# EAGLE design driver_5 (EAGLE 9.3.1)
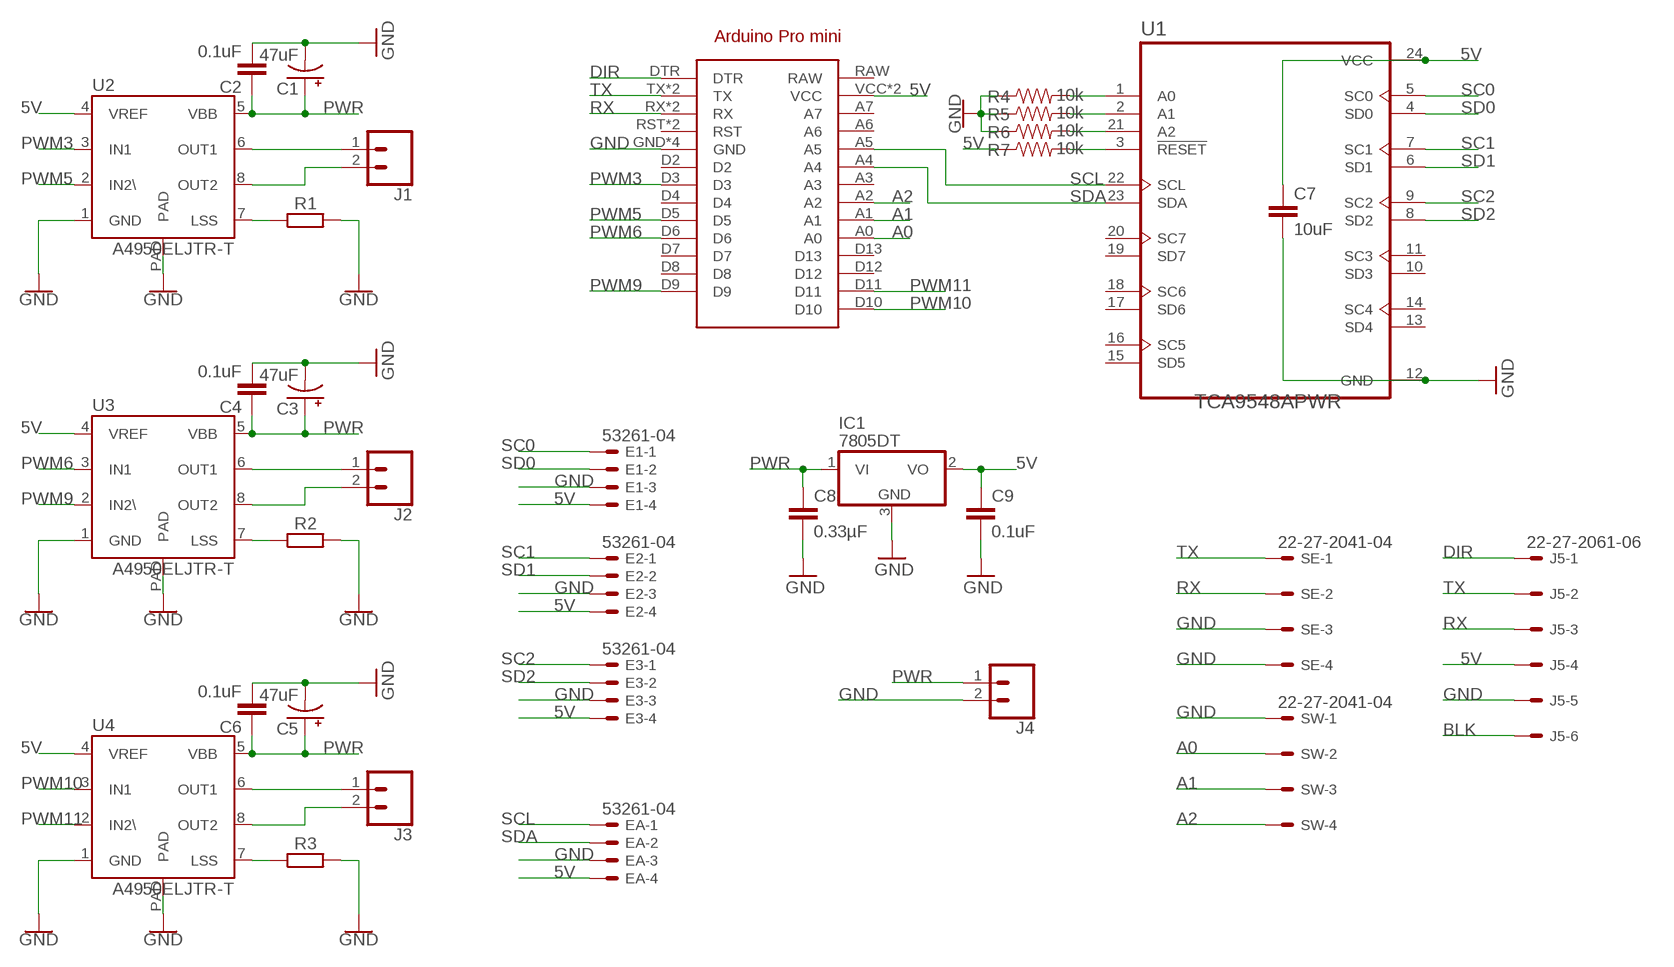
[diagram p0: schematic, sheet 1]

## Parts
ARDUINO1  ARDUINO_PRO_MINI  [ARDUINO_PRO_MINI]
C1  47uF  47UF-POLAR-EIA3528-10V-10%  [EIA3528]
C2  0.1uF  0.1UF-0402-16V-10%  [0402]
C3  47uF  47UF-POLAR-EIA3528-10V-10%  [EIA3528]
C4  0.1uF  0.1UF-0402-16V-10%  [0402]
C5  47uF  47UF-POLAR-EIA3528-10V-10%  [EIA3528]
C6  0.1uF  0.1UF-0402-16V-10%  [0402]
C7  10uF  10UF-0603-6.3V-20%  [0603]
C8  0.33µF  0.33UF/330NF-0805-50V-10%  [0805]
C9  0.1uF  0.1UF-0603-25V-(+80/-20%)  [0603]
E1  53261-04  [53261-04]
E2  53261-04  [53261-04]
E3  53261-04  [53261-04]
EA  53261-04  [53261-04]
IC1  7805DT  [TO252]
J1  CONN_025MM  [SCREWTERMINAL-5MM-2]
J2  CONN_025MM  [SCREWTERMINAL-5MM-2]
J3  CONN_025MM  [SCREWTERMINAL-5MM-2]
J4  CONN_025MM  [SCREWTERMINAL-5MM-2]
J5  22-27-2061-06  [6410-06]
R1  0.22  RR2512  [R2512]
R2  0.22  RR2512  [R2512]
R3  0.22  RR2512  [R2512]
R4  10k  10KOHM-0603-1/10W-1%  [0603]
R5  10k  10KOHM-0603-1/10W-1%  [0603]
R6  10k  10KOHM-0603-1/10W-1%  [0603]
R7  10k  10KOHM-0603-1/10W-1%  [0603]
SE  22-27-2041-04  [6410-04]
SW  22-27-2041-04  [6410-04]
U1  TCA9548APWR  [SOP65P640X120-24N]
U2  A4950ELJTR-T  [SOIC8TP]
U3  A4950ELJTR-T  [SOIC8TP]
U4  A4950ELJTR-T  [SOIC8TP]

## Nets
5V: ARDUINO1.VCC ARDUINO1.VCC@1(VCC) C7.1 C9.1 E1.4 E2.4 E3.4 EA.4 IC1.2(VO) J5.4 R7.1 U1.24(VCC) U2.4(VREF) U3.4(VREF) U4.4(VREF)
A0: ARDUINO1.A0 SW.2
A1: ARDUINO1.A1 SW.3
A2: ARDUINO1.A2 SW.4
BLK: J5.6
DIR: ARDUINO1.DTR J5.1
GND: ARDUINO1.GND ARDUINO1.GND@1(GND) ARDUINO1.GND@2(GND) ARDUINO1.GND@3(GND) C1.C(-) C2.2 C3.C(-) C4.2 C5.C(-) C6.2 C7.2 C8.2 C9.2 E1.3 E2.3 E3.3 EA.3 IC1.3(GND) J4.2 J5.5 R1.2 R2.2 R3.2 R4.1 R5.1 R6.1 SE.3 SE.4 SW.1 U1.12(GND) U2.1(GND) U2.PAD U3.1(GND) U3.PAD U4.1(GND) U4.PAD
N$3: R1.1 U2.7(LSS)
N$4: R4.2 U1.1(A0)
N$5: J1.1 U2.6(OUT1)
N$6: J1.2 U2.8(OUT2)
N$7: R2.1 U3.7(LSS)
N$8: J2.1 U3.6(OUT1)
N$9: J2.2 U3.8(OUT2)
N$10: R3.1 U4.7(LSS)
N$11: J3.1 U4.6(OUT1)
N$12: J3.2 U4.8(OUT2)
N$13: R5.2 U1.2(A1)
N$14: R6.2 U1.21(A2)
N$15: R7.2 U1.3(!RESET)
PWM3: ARDUINO1.D3 U2.3(IN1)
PWM5: ARDUINO1.D5 U2.2(IN2\)
PWM6: ARDUINO1.D6 U3.3(IN1)
PWM9: ARDUINO1.D9 U3.2(IN2\)
PWM10: ARDUINO1.D10 U4.3(IN1)
PWM11: ARDUINO1.D11 U4.2(IN2\)
PWR: C1.A(+) C2.1 C3.A(+) C4.1 C5.A(+) C6.1 C8.1 IC1.1(VI) J4.1 U2.5(VBB) U3.5(VBB) U4.5(VBB)
RX: ARDUINO1.RX ARDUINO1.RX@1(RX) J5.3 SE.2
SC0: E1.1 U1.5(SC0)
SC1: E2.1 U1.7(SC1)
SC2: E3.1 U1.9(SC2)
SCL: ARDUINO1.A5 EA.1 U1.22(SCL)
SD0: E1.2 U1.4(SD0)
SD1: E2.2 U1.6(SD1)
SD2: E3.2 U1.8(SD2)
SDA: ARDUINO1.A4 EA.2 U1.23(SDA)
TX: ARDUINO1.TX ARDUINO1.TX@1(TX) J5.2 SE.1
Unconnected: ARDUINO1.A3 ARDUINO1.A6 ARDUINO1.A7 ARDUINO1.D2 ARDUINO1.D4 ARDUINO1.D7 ARDUINO1.D8 ARDUINO1.D12 ARDUINO1.D13 ARDUINO1.RAW ARDUINO1.RST ARDUINO1.RST@1(RST) U1.10(SD3) U1.11(SC3) U1.13(SD4) U1.14(SC4) U1.15(SD5) U1.16(SC5) U1.17(SD6) U1.18(SC6) U1.19(SD7) U1.20(SC7)

## Library data of the parts
ARDUINO1 = ArduinoProMini:ARDUINO_PRO_MINI: For creating Arduino Pro Mini shields
C1 C3 C5 = SparkFun-Capacitors:47UF-POLAR: 47µF polarized capacitors A capacitor is a passive two-terminal electrical component used to store electrical energy temporarily in an electric field.; PROD_ID: CAP-08310
C2 C4 C6 = SparkFun-Capacitors:0.1UF: 0.1µF ceramic capacitors A capacitor is a passive two-terminal electrical component used to store electrical energy temporarily in an electric field.; PROD_ID: CAP-12416
C7 = SparkFun-Capacitors:10UF: 10.0µF ceramic capacitors A capacitor is a passive two-terminal electrical component used to store electrical energy temporarily in an electric field.; PROD_ID: CAP-11015
C8 = SparkFun-Capacitors:0.33UF/330NF: 0.33µF/330nF ceramic capacitors A capacitor is a passive two-terminal electrical component used to store electrical energy temporarily in an electric field.; PROD_ID: CAP-08469
C9 = SparkFun-Capacitors:0.1UF: 0.1µF ceramic capacitors A capacitor is a passive two-terminal electrical component used to store electrical energy temporarily in an electric field.; PROD_ID: CAP-00810
E1-E3 EA = con-molex:53?-04: CONNECTOR wire to board 1.25 mm (.049 inch) pitch header; MF: MOLEX; OC_FARNELL: 1125374; OC_NEWARK: unknown
IC1 = adafruit:78*: Positive VOLTAGE REGULATOR Added bigger pads to the TO-92 package
J1-J4 = SparkFun-Connectors:CONN_02: Multi connection point. Often used as Generic Header-pin footprint for 0.1 inch spaced/style header connections On any of the 0.1 inch spaced packages, you can populate with these: Break Away Headers - Straight <https://www.sparkfun.com/products/116> (PRT-00116) Break Away Male Headers - Right Angle <https://www.sparkfun.com/products/553> (PRT-00553) Female Headers <https://www.sparkfun.com/products/115> (PRT-00115) Break Away Headers - Machine Pin <https://www.sparkfun.com/products/117> (PRT-00117) Break Away Female Headers - Swiss Machine Pin <https://www.sparkfun.com/products/743> (PRT-00743) For SCREWTERMINALS and SPRING TERMINALS visit here: Screw Terimnals on SparkFun.com <https://www.sparkfun.com/search/results?term=Screw+Terminals> (5mm/3.5mm/2.54mm spacing) This device is also useful as a general connection point to wire up your design to another part of your project. Our various solder wires solder well into these plated through hole pads. Hook-Up Wire - Assortment (Stranded, 22 AWG) <https://www.sparkfun.com/products/11375> (PRT-11375) Hook-Up Wire - Assortment (Solid Core, 22 AWG) <https://www.sparkfun.com/products/11367> (PRT-11367) View the entire wire category on our website here <https://www.sparkfun.com/categories/141> Special notes: Molex polarized connector foot print use with: PRT-08233 with associated crimp pins and housings. 2.54_SCREWTERM for use with PRT-10571. 3.5mm Screw Terminal footprints for PRT-08084 5mm Screw Terminal footprints for use with PRT-08432; SF_SKU: PRT-08432
J5 = con-molex:22-?-06: CONNECTOR wire to board 2.54 mm (.1 inch) pitch header; MF: MOLEX; OC_FARNELL: unknown; OC_NEWARK: unknown
R1-R3 = eagle-ltspice:R: RESISTOR, European symbol; SPICEMODEL: NONE; SPICEPREFIX: R
R4-R7 = SparkFun-Resistors:10KOHM: 10kΩ resistor A resistor is a passive two-terminal electrical component that implements electrical resistance as a circuit element. Resistors act to reduce current flow, and, at the same time, act to lower voltage levels within circuits. - Wikipedia; PROD_ID: RES-00824
SE SW = con-molex:22-?-04: CONNECTOR wire to board 2.54 mm (.1 inch) pitch header; MF: MOLEX; OC_FARNELL: unknown; OC_NEWARK: unknown
U1 = TCA9548APWR:TCA9548APWR: Low-Voltage 8-Channel I2C Switch With Reset 24-TSSOP -40 to 85; AVAILABILITY: Unavailable; DESCRIPTION: Low-Voltage 8-Channel I2C Switch With Reset 24-TSSOP -40 to 85; MF: Texas Instruments; MP: TCA9548APWR; PACKAGE: TSSOP-24 Texas Instruments; PRICE: None
U2-U4 = A4950ELJTR-T:A4950ELJTR-T: IC MOTOR DRIVER PAR 8SOIC tested: YES (parallel gripper mcb); DESCRIPTION: Full-Bridge PWM Motor Driver 3.5A SOIC8; DIGI-KEY_PART_NUMBER: 620-1400-1-ND; DIGI-KEY_PURCHASE_URL: https://www.digikey.com/product-detail/en/allegro-microsystems-llc/A4950ELJTR-T/620-1400-1-ND/2626340?utm_source=snapeda&utm_medium=aggregator&utm_campaign=symbol; MF: RS Components; MP: A4950ELJTR-T; PACKAGE: SOIC-8 RS Components

## Net classes
0 default: width 0.406 mm

## Board
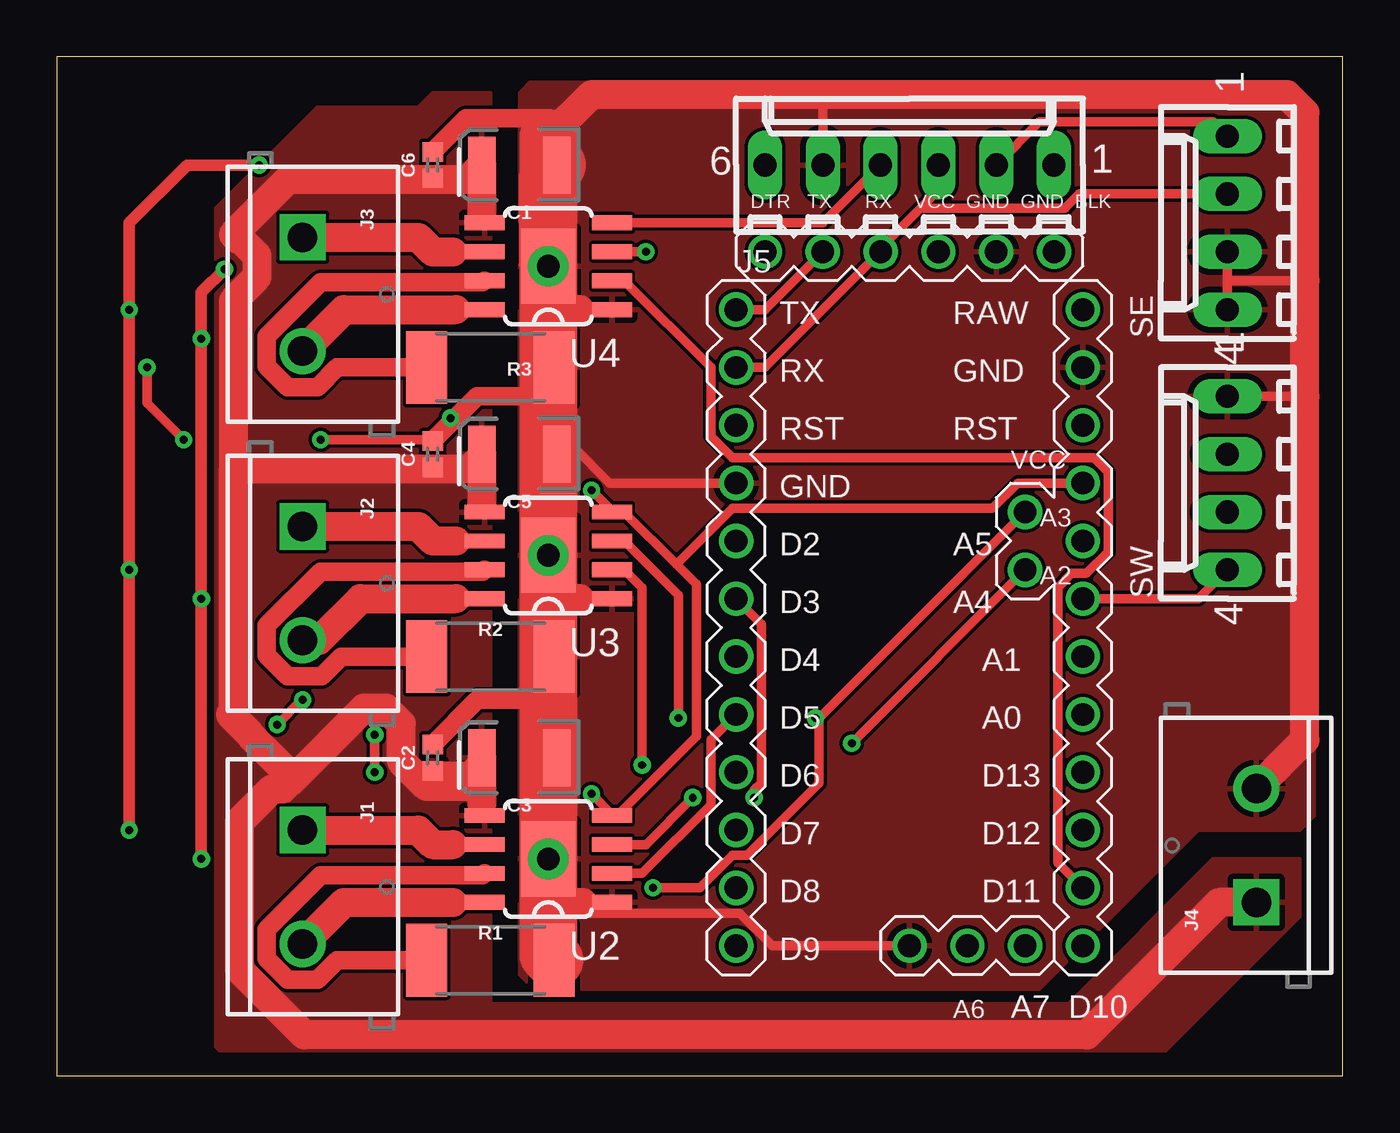
[diagram p1: board, top side]
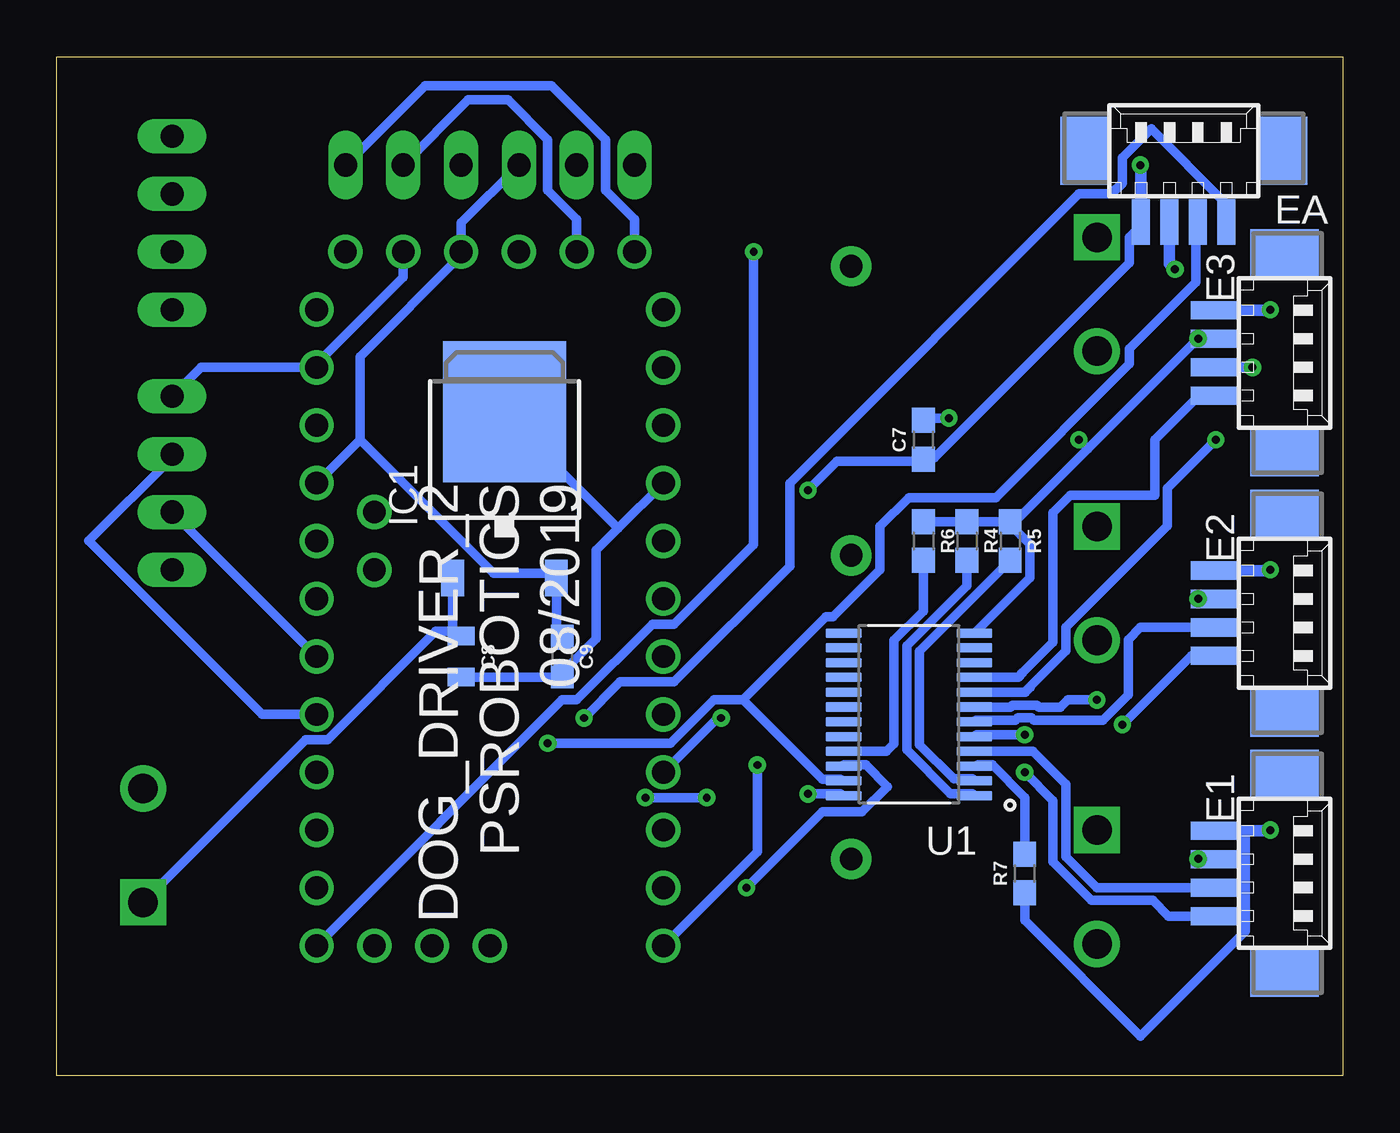
[diagram p2: board, bottom side, seen from below]

Size 56.5 x 44.76 mm. Coordinates in mm from the lower left corner, seen from the top.
Outline: 0,0 56.5,0 56.5,44.76 0,44.76 0,0
Copper layers (1*16): Top 0.035mm / dielectric 1.5mm / Bottom 0.035mm
Design rules "default": minimum track width 6mil, minimum drill 0.35mm, track to track 6mil, track to pad 6mil, pad to pad 6mil, via to via 6mil, smd to smd 6mil, copper to edge 40mil, drill to drill 6mil, minimum pad ring 10mil, minimum via ring 8mil, stop-mask expansion 4mil, vias tented up to drill 0mil, thermal gap 10mil

### Footprints (pad centres in the part's own frame; a part is rotated, then mirrored left to right if it is on the bottom)
ARDUINO_PRO_MINI = drill 1: A0 11.43,-8.89; A1 11.43,-6.35; A2 11.43,-3.81; A3 11.43,-1.27; A4 8.89,-2.54; A5 8.89,0; A6 6.35,-19.05; A7 8.89,-19.05; BLK 10.16,11.43; D2 -3.81,-1.27; D3 -3.81,-3.81; D4 -3.81,-6.35; D5 -3.81,-8.89; D6 -3.81,-11.43; D7 -3.81,-13.97; D8 -3.81,-16.51; D9 -3.81,-19.05; D10 11.43,-19.05; D11 11.43,-16.51; D12 11.43,-13.97; D13 11.43,-11.43; DTR -2.54,11.43; GND -3.81,1.27; GND@1 11.43,6.35; GND@2 7.62,11.43; GND@3 3.81,-19.05; RAW 11.43,8.89; RST 11.43,3.81; RST@1 -3.81,3.81; RX -3.81,6.35; RX@1 2.54,11.43; TX -3.81,8.89; TX@1 0,11.43; VCC 11.43,1.27; VCC@1 5.08,11.43
EIA3528 = smd 1.2 x 2.5: A 1.65,0; C -1.65,0
0402 = smd 0.85 x 0.9: 1 -0.58,0; 2 0.58,0
0603 = smd 1.1 x 1: 1 -0.85,0; 2 0.85,0
0805 = smd 0.8 x 1.2: 1 -0.9,0; 2 0.9,0
53261-04 = smd 0.8 x 2: 1 1.875,-2.5; 2 0.625,-2.5; 3 -0.625,-2.5; 4 -1.875,-2.5 | smd 2.1 x 3: S1 4.375,0.625; S2 -4.375,0.625
TO252 = smd 1 x 1.6: 1 -2.28,-4.8; 2 2.28,-4.8 | smd 5.4 x 6.2: 3 0,2.5
SCREWTERMINAL-5MM-2 = drill 1.3 pad 2.032 square: 1 0,0 | drill 1.3 pad 2.032: 2 5,0
6410-06 = drill 1.016 long: 1 6.35,0; 2 3.81,0; 3 1.27,0; 4 -1.27,0; 5 -3.81,0; 6 -6.35,0
R2512 = smd 1.8 x 3.2: 1 -2.8,0; 2 2.8,0
6410-04 = drill 1.016 long: 1 3.81,0; 2 1.27,0; 3 -1.27,0; 4 -3.81,0
SOP65P640X120-24N = smd 1.57 x 0.41: 1 -2.87,3.575; 2 -2.87,2.925; 3 -2.87,2.275; 4 -2.87,1.625; 5 -2.87,0.975; 6 -2.87,0.325; 7 -2.87,-0.325; 8 -2.87,-0.975; 9 -2.87,-1.625; 10 -2.87,-2.275; 11 -2.87,-2.925; 12 -2.87,-3.575; 13 2.87,-3.575; 14 2.87,-2.925; 15 2.87,-2.275; 16 2.87,-1.625; 17 2.87,-0.975; 18 2.87,-0.325; 19 2.87,0.325; 20 2.87,0.975; 21 2.87,1.625; 22 2.87,2.275; 23 2.87,2.925; 24 2.87,3.575
SOIC8TP = smd 1.75 x 0.65: 1 -2.8,1.905; 2 -2.8,0.635; 3 -2.8,-0.635; 4 -2.8,-1.905; 5 2.8,-1.905; 6 2.8,-0.635; 7 2.8,0.635; 8 2.8,1.905 | smd 2.41 x 3.3: PAD 0,0

### Placement (x,y rotation side)
ARDUINO1  33.66,24.77 0 top
C1  20.32,40.01 180 top
C2  16.51,13.97 90 top
C3  20.32,13.97 180 top
C4  16.51,27.3 90 top
C5  20.32,27.3 180 top
C6  16.51,40.01 90 top
C7  18.41,27.94 90 bottom
C8  38.73,18.41 270 bottom
C9  34.29,18.41 270 bottom
E1  3.17,8.89 270 bottom
E2  3.17,20.32 270 bottom
E3  3.17,31.75 270 bottom
EA  6.99,40.01 0 bottom
IC1  36.83,26.67 0 bottom
J1  10.79,10.8 270 top
J2  10.79,24.13 270 top
J3  10.79,36.83 270 top
J4  52.71,7.62 90 top
J5  37.47,40.01 0 top
R1  19.05,5.08 0 top
R2  19.05,18.41 0 top
R3  19.05,31.11 0 top
R4  16.51,23.5 270 bottom
R5  14.61,23.5 270 bottom
R6  18.41,23.5 270 bottom
R7  13.97,8.89 90 bottom
SE  51.44,37.47 90 top
SW  51.44,26.04 90 top
U1  19.05,15.88 180 bottom
U2  21.59,9.52 180 top
U3  21.59,22.86 180 top
U4  21.59,35.56 180 top

### Tracks (layer width: path | path; a pad name or v marks a point on that pad's centre or on a via)
5V  (via drill 0.35)
  Top 0.406: v23.49,12.38 24.45,11.43 U2.4 24.61,11.43 28.1,14.92 28.1,21.59 27.23,22.46 | 27.23,22.46 24.92,24.77 U3.4 24.29,24.92 v23.49,25.72 | U4.4 33.66,37.47 J5.4 | 27.23,22.46 29.69,24.92 41.12,24.92 42.23,26.04 ARDUINO1.VCC
  Top 0.508: v3.17,10.8 v3.17,22.22 v3.17,33.66 3.17,37.47 5.71,40.01 v8.89,40.01
  Bottom 0.406: C9.1 34.55,19.52 IC1.2 34.61,22.07 37.31,22.07 43.18,27.94 | R7.1 13.97,6.83 8.89,1.75 4.29,6.35 4.29,10.77 | EA.4 8.89,37.31 9.37,36.83 9.37,35.72 17.94,27.15 18.41,27.15 C7.1 18.57,26.99 22.22,26.99 v23.49,25.72 | v23.49,12.38 22.07,12.38 U1.24 | ARDUINO1.VCC 43.18,27.94 | J5.4 38.73,37.47 ARDUINO1.VCC@1 38.73,36.04 43.18,31.59 43.18,27.94
  Bottom 0.508: E3.4 3.21,33.62 v3.17,33.66 | v3.17,22.22 3.21,22.2 E2.4 | E1.4 4.29,10.77 3.21,10.77 v3.17,10.8 | EA.4 8.86,39.98 v8.89,40.01
A0
  Bottom 0.406: ARDUINO1.A0 47.47,15.88 55.09,23.5 51.44,27.15 SW.2
A1
  Bottom 0.406: SW.3 ARDUINO1.A1
A2
  Top 0.406: ARDUINO1.A2 50.16,20.95 SW.4
DIR
  Bottom 0.406: ARDUINO1.DTR 31.11,37.62 32.39,38.89 32.39,41.12 34.77,43.5 40.32,43.5 J5.1
GND  (via drill 0.35, 1 pad 1.78)
  Top 0.406: SE.3 51.44,34.93 | 51.44,34.93 SE.4 | v17.3,28.89 17.41,28.79 | J5.5 33.66,43.1 | U2.1 23.11,7.62 23.49,7.14 30,7.14 31.43,5.72 ARDUINO1.GND@3 | 22.99,20.95 U3.1 | 22.99,33.66 U4.1 | 22.07,13.97 C3.C 21.59,13.97 | 22.07,27.3 C5.C 21.59,27.3 | 20.8,42.06 20.8,42.07 21.59,41.2 | 21.91,18.41 R2.2 21.59,18.41 | 21.91,31.11 R3.2 21.59,31.11 | 54.84,34.93 51.44,34.93 | v11.59,27.94 16.19,27.94 C4.2 | ARDUINO1.GND 24.29,26.04 22.7,27.62 21.59,27.62 | 54.84,29.85 SW.1
  Top 0.508: v6.35,9.52 v6.35,20.95 v6.35,32.39 6.35,34.42 v7.37,35.43
  Top 0.813: C2.2 18.47,16.51 21.59,16.51 | C4.2 17.41,28.79 18.47,29.85 21.59,29.85 | C6.2 17.99,42.06 20.8,42.06 21.59,42.06
  Top 1.27: 21.59,33.66 22.99,33.66 | 21.59,20.95 22.99,20.95 | 21.59,7.62 23.11,7.62 | J4.2 54.84,14.76 54.84,29.85 54.84,34.93 54.84,42.31 54.05,43.1 33.66,43.1 23.49,43.1 21.59,41.2
  Top 2.54: U4.PAD 21.59,33.66 21.59,31.11 21.59,29.85 21.59,27.62 21.59,27.3 U3.PAD 21.59,20.95 21.59,18.41 21.59,16.51 21.59,13.97 U2.PAD 21.59,7.62 21.59,5.34 R1.2 | U4.PAD 21.59,39.62 C1.C | 21.59,41.2 U4.PAD
  Bottom 0.406: R5.1 R4.1 R6.1 | R5.1 14.61,24.2 13.75,23.34 13.75,21.88 U1.12 | C8.2 34.34,17.52 C9.2 34.29,17.71 32.8,19.2 32.8,23.08 31.83,24.05 | 31.83,24.05 ARDUINO1.GND | SW.1 50.16,31.11 ARDUINO1.GND@1 45.09,31.27 41.27,35.08 ARDUINO1.GND@2 | 31.83,24.05 36.83,29.05 IC1.3 | 11.19,27.54 6.51,32.23 E3.3 | 11.19,27.54 14.29,24.45 14.45,24.45 R5.1 | v17.3,28.89 18.41,28.89 C7.2 | v11.59,27.94 11.19,27.54
  Bottom 0.508: E3.3 6.34,32.38 v6.35,32.39 | E2.3 6.34,20.95 v6.35,20.95 | E1.3 v6.35,9.52 | EA.3 7.61,35.68 v7.37,35.43
  other vias: 21.59,35.56 21.59,22.86 21.59,9.52
  pour Top: 20.32,43.18 20.32,4.45 20.95,3.81 43.18,3.81 50.16,10.8 54.61,10.8 55.25,11.43 55.25,42.55 53.98,43.82 20.95,43.82
N$3
  Top 0.813: U2.7 18.71,8.81 11.59,8.81 9.22,6.45 9.22,5.14 10.14,4.22 11.45,4.22 12.31,5.08 R1.1
N$4
  Bottom 0.406: R4.2 16.51,21.53 19.15,18.89 19.15,14.32 17.22,12.39 16.27,12.39 U1.1
N$5
  Top 0.406: 17.4,10.16 U2.6
  Top 1.27: J1.1 15.88,10.8 16.51,10.16 17.4,10.16
N$6
  Top 0.406: 17.4,7.62 U2.8
  Top 1.27: J1.2 12.62,7.62 17.4,7.62
N$7
  Top 0.813: U3.7 18.71,22.15 11.59,22.15 9.22,19.78 9.22,18.48 10.14,17.55 11.62,17.55 12.48,18.41 R2.1
N$8
  Top 0.406: 17.53,23.5 U3.6
  Top 1.27: J2.1 15.88,24.13 16.51,23.5 17.53,23.5
N$9
  Top 0.406: 17.53,20.95 U3.8
  Top 1.27: J2.2 11.51,19.13 13.34,20.95 17.53,20.95
N$10
  Top 0.813: U4.7 18.71,34.85 11.59,34.85 9.22,32.48 9.22,31.18 10.14,30.25 11.45,30.25 12.31,31.11 R3.1
N$11
  Top 0.406: 17.4,36.2 U4.6
  Top 1.27: J3.1 15.88,36.83 16.51,36.2 17.4,36.2
N$12
  Top 0.406: 17.53,33.66 U4.8
  Top 1.27: J3.2 12.62,33.66 17.53,33.66
N$13
  Bottom 0.406: U1.2 16.27,13.04 17.08,13.04 18.59,14.55 18.59,18.66 R5.2
N$14
  Bottom 0.406: R6.2 18.41,20.42 19.71,19.12 19.71,14.58 20.04,14.25 U1.21
N$15
  Bottom 0.406: R7.2 13.97,12.22 15.4,13.65 16.03,13.65 U1.3
PWM3  (via drill 0.35)
  Top 0.406: U2.3 25.88,10.16 v27.94,12.22 | v30.64,12.22 30.64,12.54 30.96,12.86 30.96,19.84 ARDUINO1.D3
  Bottom 0.406: v30.64,12.22 v27.94,12.22
PWM5
  Top 0.406: U2.2 25.72,8.89 28.73,11.91 28.73,14.76 ARDUINO1.D5
PWM6  (via drill 0.35)
  Top 0.406: U3.3 24.92,23.5 27.3,21.11 v27.3,15.72
  Bottom 0.406: v27.3,15.72 27.46,15.72 ARDUINO1.D6
PWM9  (via drill 0.35)
  Top 0.406: U3.2 24.92,22.22 25.72,21.43 v25.72,13.65
  Bottom 0.406: v25.72,13.65 25.72,9.84 ARDUINO1.D9
PWM10  (via drill 0.35)
  Top 0.406: v25.88,36.2 U4.3
  Bottom 0.406: v25.88,36.2 25.88,23.34 29.37,19.84 30.32,19.84 33.66,16.51 34.29,16.51 ARDUINO1.D10
PWM11
  Top 0.406: U4.2 24.92,34.93 28.73,31.11 28.73,28.1 29.69,27.15 45.56,27.15 46.2,26.51 46.2,23.02 45.24,22.07 44.61,22.07 43.97,21.43 43.97,9.37 ARDUINO1.D11
PWR
  Top 0.406: U2.5 18.73,11.43 18.67,11.94 | 18.67,37.85 18.73,37.47 U4.5 | U3.5 18.73,24.77 18.67,25.15
  Top 0.813: C2.1 18.09,13.39 C3.A | C4.1 18.09,26.72 C5.A | C6.1 18.09,39.43 C1.A
  Top 1.27: 18.67,37.85 C1.A 18.04,39.37 10.16,39.37 7.75,36.96 7.98,36.73 8.1,36.73 8.79,36.04 8.79,35.08 7.75,34.04 7.75,26.67 | C5.A 18.67,27.18 | 18.67,27.18 18.67,25.15 | C3.A 18.67,12.7 | 18.67,12.7 18.67,11.94 | 7.75,26.67 18.16,26.67 18.67,27.18 | 18.67,12.7 16.25,12.7 15.14,13.82 15.14,15.47 14.45,16.15 13.49,16.15 10.42,13.08 | 10.42,13.08 10.38,13.08 8.51,14.95 8.51,14.99 7.62,15.88 7.75,16 7.75,26.67 | J4.1 51.08,7.62 45.26,1.8 10.87,1.8 8.03,4.65 8.03,11.17 9.45,12.6 9.94,12.6 10.42,13.08
  Bottom 0.406: IC1.1 39.11,19.69 C8.1 39.21,19.53 39.85,19.53 44.61,14.76 45.56,14.76 J4.1
  pour Top: 19.05,43.18 19.05,3.17 44.45,3.17 50.8,9.52 54.61,9.52 54.61,6.99 51.44,3.81 48.26,0.64 7.62,0.64 6.99,1.27 6.99,38.1 11.43,42.55 15.88,42.55 16.51,43.18
RX
  Top 0.406: ARDUINO1.RX 31.11,31.11 ARDUINO1.RX@1 36.2,36.35 38.02,38.18 | J5.3 38.73,38.89 38.02,38.18 | SE.2 44.93,38.73 44.29,38.1 38.1,38.1 38.02,38.18
SC0  (via drill 0.35)
  Top 0.406: v13.97,13.34 v13.97,14.98
  Bottom 0.406: E1.1 7.65,7.01 8.34,7.71 11.03,7.71 12.72,9.4 12.72,12.09 v13.97,13.34 | v13.97,14.98 16.1,14.98 U1.5
SC1  (via drill 0.35)
  Top 0.406: v9.68,15.43 10.76,16.51 v10.79,16.51
  Bottom 0.406: E2.1 6.66,18.45 v9.68,15.43 | v10.79,16.51 12.06,16.51 12.39,16.18 13.34,16.18 13.44,16.28 14.51,16.28 14.6,16.18 16.16,16.18 U1.7
SC2
  Bottom 0.406: 14.04,17.72 14.26,17.5 U1.9 14.28,17.5 12.72,19.05 12.72,24.73 11.96,25.5 8.26,25.5 8.26,27.94 6.32,29.87 E3.1
SCL  (via drill 0.35)
  Top 0.406: v26.19,8.25 28.26,8.25 29.69,9.68 30.32,9.68 33.5,12.86 33.5,15.72 | ARDUINO1.A5 33.5,15.72 | v33.34,15.72 33.5,15.72
  Bottom 0.406: v26.19,8.25 22.86,11.59 21.11,11.59 20,12.7 20.95,13.65 21.91,13.65 U1.22 | v33.34,15.72 31.75,17.3 29.37,17.3 24.29,22.38 24.29,26.04 11.59,38.73 10.16,38.73 9.68,39.21 9.68,40.32 8.41,41.59 5.24,38.42 5.24,37.62 EA.1
SD0
  Bottom 0.406: E1.2 10.8,8.27 12.17,9.63 12.17,12.8 13.62,14.25 U1.4
SD1
  Bottom 0.406: E2.2 8.88,19.7 9.42,19.15 9.42,16.74 10.54,15.62 13.57,15.62 13.67,15.72 14.27,15.72 14.37,15.62 16.11,15.62 U1.6
SD2  (via drill 0.35)
  Top 0.406: v5.57,27.94 3.96,29.55 v3.96,31.11
  Bottom 0.406: 13.73,17.07 13.95,16.85 U1.8 13.99,16.85 12.17,18.67 12.17,19.7 7.7,24.17 7.7,25.81 v5.57,27.94 | E3.2 3.97,31.12 v3.96,31.11
SDA  (via drill 0.35)
  Top 0.406: v34.93,14.61 ARDUINO1.A4
  Bottom 0.406: 26.35,16.51 22.86,13.02 22.07,13.02 U1.23 | 26.35,16.51 22.7,20.16 22.38,20.16 20.32,22.22 20.32,24.13 19.05,25.4 15.24,25.4 9.37,31.27 9.37,31.94 6.45,34.86 6.45,37.48 EA.2 | v34.93,14.61 29.53,14.61 27.62,16.51 26.35,16.51
TX
  Top 0.406: ARDUINO1.TX 31.11,33.66 ARDUINO1.TX@1 | J5.2 43.18,41.91 50.8,41.91 SE.1
  Bottom 0.406: ARDUINO1.TX@1 33.66,37.62 34.93,38.89 34.93,41.12 36.67,42.86 38.42,42.86 J5.2

### Text on the board
bPlace: DOG_DRIVER_2 / PSROBOTICS / 08/2019